# Altium project chipjabber-bbi-simplev1.PrjPcb
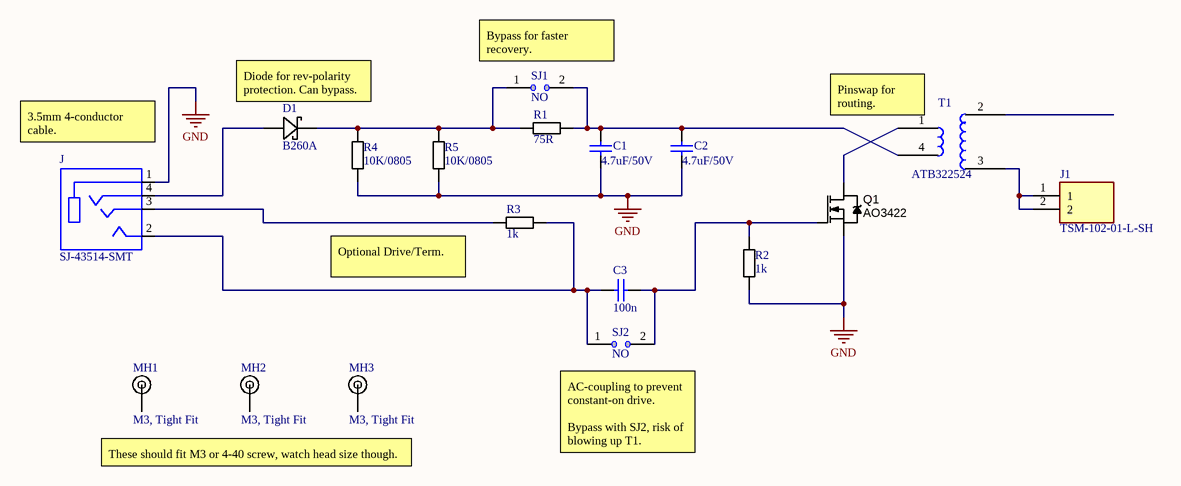
[diagram p0: chipjabbersimplev1.SchDoc]
PrjLicense: CC BY SA 3.0; PrjName: BasicBBI; PrjRev: 01
1 sheet, 18 parts. Net scope: global (net labels, ports and power ports of the same name join across sheets).
Board file: bbi-simple-rev1.PcbDoc

## Sheet chipjabbersimplev1.SchDoc: ChipJabber-BasicBBI Rev1
size Letter; Organization: NewAE Technology Inc.; Address1: 1083 Queen St., Suite 196; Address2: Halifax; Address3: NS; Address4: Canada B3H 0B2; DocumentNumber: .; Revision: .; SheetNumber: 1; SheetTotal: 1; SheetApproved: YES

### Parts
C1  4.7uF/50V  [CAPC0805_M]
C2  4.7uF/50V  [CAPC0805_M]
C3  100n  [CAPC0603_M]
D1  B260A  [DIOM4326X23N]
J  SJ-43514-SMT  [CUI_SJ-43514-SMT]
J1  TSM-102-01-L-SH  [TSM-102-YY-ZZZ-SH]
MH1  M3, Tight Fit  [MOUNT_M3_TIGHT]
MH2  M3, Tight Fit  [MOUNT_M3_TIGHT]
MH3  M3, Tight Fit  [MOUNT_M3_TIGHT]
Q1  AO3422  [SOT95P245X110-3M]
R1  75R  [RESC2012X70N]
R2  1k  [RESC1608X55N]
R3  1k  [RESC1608X55N]
R4  10K/0805  [RESC2012X70N]
R5  10K/0805  [RESC2012X70N]
SJ1  NO  [SJ_2S_NO]  (no BOM)
SJ2  NO  [SJ_2S_NO]  (no BOM)
T1  ATB322524  [ATB322524_CHUNKY]

### Nets
GND: C1.2 C2.2 J.1(SLEEVE) Q1.2(S) R2.2 R4.2 R5.2
NetC1_1: C1.1 C2.1 R1.2 SJ1.2 T1.4
NetC3_1: C3.1 J.2(TIP) R3.2 SJ2.1
NetC3_2: C3.2 Q1.1(G) R2.1 SJ2.2
NetD1_A: D1.A J.4(RING2)
NetD1_K: D1.K R1.1 R4.1 R5.1 SJ1.1
NetJ1_1: J1.1 J1.2 T1.3
NetJ_3: J.3(RING1) R3.1
NetQ1_3: Q1.3(D) T1.1

Not connected (* = marked no-connect by the designer): MH1 1; MH2 1; MH3 1; T1 2

### Notes on the sheet
- Diode for rev-polarity protection. Can bypass.
- (near SJ1) Bypass for faster recovery.
- (near T1) Pinswap for routing.
- (near J) 3.5mm 4-conductor cable.
- Optional Drive/Term.
- (near SJ2) AC-coupling to prevent constant-on drive.
  Bypass with SJ2, risk of blowing up T1.
- These should fit M3 or 4-40 screw, watch head size though.
- Title:
- Date:
- Rev:
- Time:
- Project:
- Sheet
- of
- License:
- Copyright © NewAE Technology Inc.
- Approved:
- NewAE.com
- File:

### Library data of the parts
C1 C2 = CCHIP-4u7-0805-50V: 4u7, 50V, 0805, Ceramic; Manufacture 1: TDK Corporation; Manufacture Part Number 1: C2012X5R1H475K125AB; Component Group: Capacitor; Value: 4.7uF; Case-EIA: 0805; Case-Metric: 1608; Rated Voltage: 50VDC; Tolerance: 10%; Part Number: CCHIP-4u7-0805-50V; Footprint: 0805; Pin Count: 2; Supplier 1: Digi-Key; Supplier Part Number 1: 445-5980-1-ND; Mounting Technology: SMT; RoHS: Yes; Temperature Range: -55C to 85C; Component Kind: Standard; Component Type: Standard
C3 = CCHIP-100n-0603: 100n, 0603; Manufacture 1: Kemet; Manufacture Part Number 1: C0603C104K5RACTU; Component Group: Capacitor; Case-EIA: 0603; Case-Metric: 1608; Rated Voltage: 50VDC; Part Number: CCHIP-100n-0603; Footprint: 0603; Pin Count: 2; Supplier 1: Digi-Key; Supplier Part Number 1: 399-5089-2-ND; Value: 100n; Mounting Technology: SMT; Component Kind: Standard; Component Type: Standard
D1 = DIODE_SCHOTTKY_2A: DIODE SCHOTTKY 60V 2A SMA; Manufacture 1: Diodes Incorporated; Manufacture Part Number 1: B260A-13-F; PP Material Stack: 0; Part Number: DIODE_SCHOTTKY_2A; Component Group: Diode; Footprint: DO-214AC; Pin Count: 2; Supplier 1: Digi-Key; Supplier Part Number 1: B260A-FDICT-ND; Mounting Technology: SMT; RoHS: Yes; Component Kind: Standard; Component Type: Standard; PP Rotation: 0
J = SJ-43514-SMT: 4 conductor TRS, 3.5mm; Manufacture Part Number 1: SJ-43514-SMT-TR; MF: CUI Devices; Component Group: Connector; PP Material Stack: 0; Price: None; Package: None; Availability: Unavailable; SnapEDA_Link: https://www.snapeda.com/parts/SJ-43514-SMT/CUI%20Devices/view-part/511208/?ref=snap; Value: *; MP: SJ-43514-SMT; Part Number: SJ-43514-SMT; Footprint: SJ-43514-SMT; Manufacture 1: CUI Devices; Pin Count: 4; Supplier 1: Digi-Key; Supplier Part Number 1: CP-43514SJCT-ND; Component Kind: Standard; Component Type: Standard; PP Rotation: 0; PP Rotation1: 0
J1 = TSM-102-01-L-SH: Connector; Manufacturer_Name: SAMTEC; Datasheet Link: http://suddendocs.samtec.com/prints/tsm-1xx-xx-xxx-xx-x-xxx-x-mkt.pdf; Manufacturer_Part_Number: TSM-102-01-L-SH; Mouser Part Number: 200-TSM10201LSH; Mouser Price/Stock: https://www.mouser.co.uk/ProductDetail/Samtec/TSM-102-01-L-SH?qs=0lQeLiL1qyaA4kL5bMFTfA%3D%3D; Arrow Part Number: TSM-102-01-L-SH; Arrow Price/Stock: https://www.arrow.com/en/products/tsm-102-01-l-sh/samtec
MH1-MH3 = MOUNT_M3_TIGHT: Machine screw M3 Mounting Hole; Component Group: Mechanical; PP Material Stack: 0; Part Number: MOUNT_M3_TIGHT; Pin Count: 1; Component Kind: Mechanical; Component Type: Mechanical; PP Rotation: 0
Q1 = DMN3200U-7: MOSFET N-CH 30V 2.2A SOT23-3; Manufacture 1: Diodes Inc.; Rated Power: 3A; PP Material Stack: 0; Part Number: DMN3200U-7; Component Group: MOSFET; Footprint: SOT23; Manufacture Part Number 1: DMN3200U-7; Pin Count: 3; Supplier 1: Digi-Key; Supplier Part Number 1: DMN3200U-7DICT-ND; Rated Voltage: 30V; Mounting Technology: SMT; RoHS: Yes; Component Kind: Standard; Component Type: Standard; PP Rotation: 0
R1 R4 R5 = RCHIP-75R-0805: 75R res, 0805, 1%, 1/8W; Manufacture 1: Yageo; Manufacture Part Number 1: RC0805FR-0775RL; Component Group: Resistor; Case-EIA: 0805; Rated Power: 0.125W; Rated Voltage: 75VDC; Part Number: RCHIP-75R-0805; Footprint: 0805; Pin Count: 2; Supplier 1: Digi-Key; Supplier Part Number 1: 311-75.0CRCT-ND; Value: 75R; Tolerance: 1%; Mounting Technology: SMT; Temperature Range: -55C to 155C; Component Kind: Standard; Component Type: Standard
R2 R3 = RCHIP-1K-0603: 1k res, 0603, 1%, 1/10W; Manufacture 1: Yageo; Manufacture Part Number 1: RC0603FR-071KL; Component Group: Resistor; Case-EIA: 0603; Case-Metric: 1608; Rated Power: 0.1W; Rated Voltage: 75VDC; Part Number: RCHIP-1K-0603; Footprint: 0603; Pin Count: 2; Supplier 1: Digi-Key; Supplier Part Number 1: 311-1.00KHRCT-ND; Value: 1k; Tolerance: 1%; Mounting Technology: SMT; Temperature Range: -55C to 155C; Component Kind: Standard; Component Type: Standard
SJ1 SJ2 = SJ_2S_NO: Solder Jumper, NO; Component Group: PCB Feature; Part Number: SJ_2S_NO; Pin Count: 2; Mounting Technology: COPPER; Component Type: Standard (No BOM)
T1 = ATB322524_PROTO: HV Transformer 1:10, Small; Manufacture 1: TDK; Component Group: Inductor; Part Number: ATB322524_PROTO; Footprint: ATB322524; Manufacture Part Number 1: ATB322524; Pin Count: 4; Supplier 1: Mouser; Mounting Technology: SMT; RoHS: Yes; Component Kind: Standard; Component Type: Standard